# Altium project Schaltbox RemotePC-Renault.PrjPCB
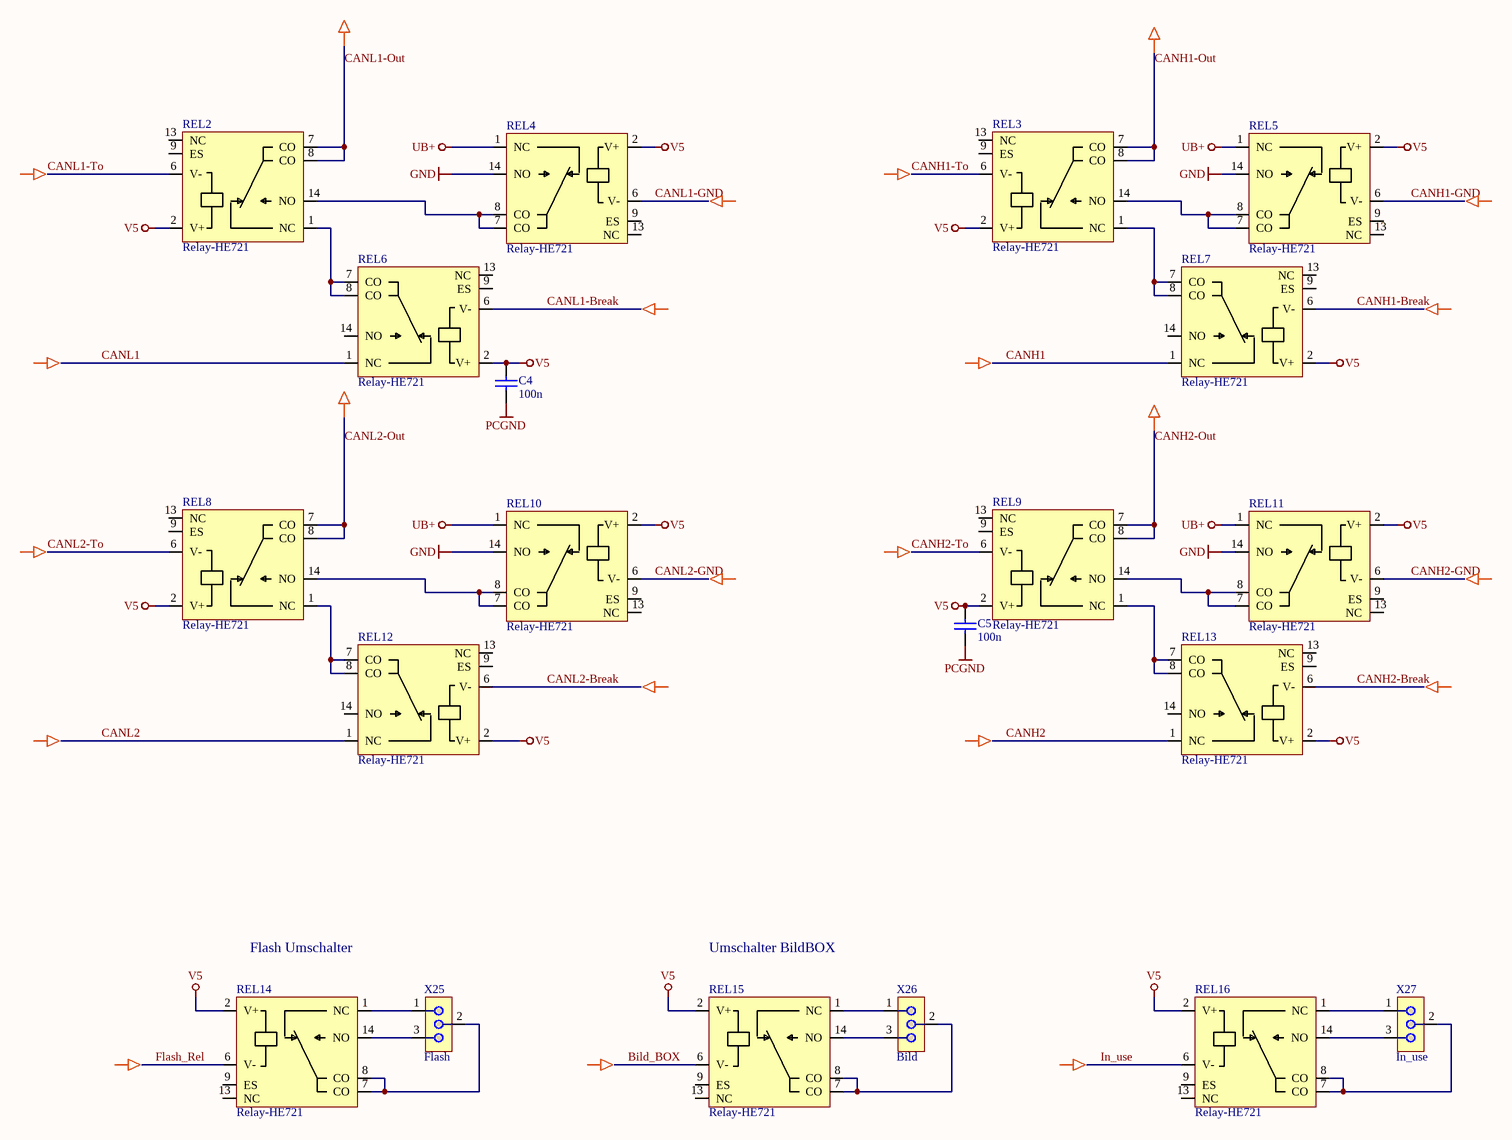
[diagram p0: Schaltbox-Renault_Switch.SchDoc]
3 sheets, 218 parts. Net scope: global (net labels, ports and power ports of the same name join across sheets).
Board file: Schaltbox-Renault_iso.PcbDoc
Sheets:
  Schaltbox-Renault_Switch.SchDoc
  Schaltbox-Renault_Extension.SchDoc
  Schaltbox-Renault_iso.SchDoc

## Sheet Schaltbox-Renault_Switch.SchDoc: Schaltbox für PC I/O - Switches
size A3; Organization: Schleißheimer GmbH; Address2: Am Kalkofen 10; Address3: D-61206 Wöllstadt; Address4: Deutschland; Revision: 1.0; SheetNumber: 2; SheetTotal: 2; PageSetup: Record=PageOptions|CenterHorizontal=True|CenterVertical=True|PrintScale=0.70|XCorrection=1.00|YCorrection=1.00|PrintKind=0|BorderSize=5000000|LeftOffset=0|BottomOffset=0|Orientation=2|PaperLength=1000|PaperWidth=1000|Scale=100|PaperSource=7|PrintQuality=-4|MediaType=1|DitherType=10|PrintScaleMode=1|PaperKind=A4|PaperIndex=9; ProjectName: Remote AP

### Parts
(Parts that share a designator on the sheet are numbered #1, #2 ... from top to bottom, then left to right.)
*#1  Pfeil-->  (value not drawn)  (graphical)
*#2  Pfeil-->  (value not drawn)  (graphical)
*#3  Pfeil-->  (value not drawn)  (graphical)
*#4  Pfeil-->  (value not drawn)  (graphical)
*#5  Pfeil-->  (value not drawn)  (graphical)
*#6  Pfeil-->  (value not drawn)  (graphical)
*#7  Pfeil-->  (value not drawn)  (graphical)
*#8  Pfeil-->  (value not drawn)  (graphical)
*#9  Pfeil-->  (value not drawn)  (graphical)
*#10  Pfeil-->  (value not drawn)  (graphical)
*#11  Pfeil-->  (value not drawn)  (graphical)
*#12  Pfeil-->  (value not drawn)  (graphical)
*#13  Pfeil-->  (value not drawn)  (graphical)
*#14  Pfeil-->  (value not drawn)  (graphical)
*#15  Pfeil-->  (value not drawn)  (graphical)
*#16  Pfeil-->  (value not drawn)  (graphical)
*#17  Pfeil-->  (value not drawn)  (graphical)
*#18  Pfeil-->  (value not drawn)  (graphical)
*#19  Pfeil-->  (value not drawn)  (graphical)
*#20  Pfeil-->  (value not drawn)  (graphical)
*#21  Pfeil-->  (value not drawn)  (graphical)
*#22  Pfeil-->  (value not drawn)  (graphical)
*#23  Pfeil-->  (value not drawn)  (graphical)
C4  100n  [C0603MD]
C5  100n  [C0603MD]
REL2  Relay-HE721  [DIP14 - HE700]
REL3  Relay-HE721  [DIP14 - HE700]
REL4  Relay-HE721  [DIP14 - HE700]
REL5  Relay-HE721  [DIP14 - HE700]
REL6  Relay-HE721  [DIP14 - HE700]
REL7  Relay-HE721  [DIP14 - HE700]
REL8  Relay-HE721  [DIP14 - HE700]
REL9  Relay-HE721  [DIP14 - HE700]
REL10  Relay-HE721  [DIP14 - HE700]
REL11  Relay-HE721  [DIP14 - HE700]
REL12  Relay-HE721  [DIP14 - HE700]
REL13  Relay-HE721  [DIP14 - HE700]
REL14  Relay-HE721  [DIP14 - HE700]
REL15  Relay-HE721  [DIP14 - HE700]
REL16  Relay-HE721  [DIP14 - HE700]
X25  Flash  [Stifte_1x3]
X26  Bild  [Stifte_1x3]
X27  In_use  [Stifte_1x3]

### Nets
GND: REL4.14(NO) REL5.14(NO) REL10.14(NO) REL11.14(NO)
PCGND: C4.1 C5.1
UB+: REL4.1(NC) REL5.1(NC) REL10.1(NC) REL11.1(NC)
V5: C4.2 C5.2 REL2.2(V+) REL3.2(V+) REL4.2(V+) REL5.2(V+) REL6.2(V+) REL7.2(V+) REL8.2(V+) REL9.2(V+) REL10.2(V+) REL11.2(V+) REL12.2(V+) REL13.2(V+) REL14.2(V+) REL15.2(V+) REL16.2(V+)
Bild_BOX: REL15.6(V-)
CANH1: REL7.1(NC)
CANH1-Break: REL7.6(V-)
CANH1-GND: REL5.6(V-)
CANH1-Out: REL3.7(CO) REL3.8(CO)
CANH1-To: REL3.6(V-)
CANH2: REL13.1(NC)
CANH2-Break: REL13.6(V-)
CANH2-GND: REL11.6(V-)
CANH2-Out: REL9.7(CO) REL9.8(CO)
CANH2-To: REL9.6(V-)
CANL1: REL6.1(NC)
CANL1-Break: REL6.6(V-)
CANL1-GND: REL4.6(V-)
CANL1-Out: REL2.7(CO) REL2.8(CO)
CANL1-To: REL2.6(V-)
CANL2: REL12.1(NC)
CANL2-Break: REL12.6(V-)
CANL2-GND: REL10.6(V-)
CANL2-Out: REL8.7(CO) REL8.8(CO)
CANL2-To: REL8.6(V-)
Flash_Rel: REL14.6(V-)
In_use: REL16.6(V-)
NetREL2_1: REL2.1(NC) REL6.7(CO) REL6.8(CO)
NetREL2_14: REL2.14(NO) REL4.7(CO) REL4.8(CO)
NetREL3_1: REL3.1(NC) REL7.7(CO) REL7.8(CO)
NetREL3_14: REL3.14(NO) REL5.7(CO) REL5.8(CO)
NetREL8_1: REL8.1(NC) REL12.7(CO) REL12.8(CO)
NetREL8_14: REL8.14(NO) REL10.7(CO) REL10.8(CO)
NetREL9_1: REL9.1(NC) REL13.7(CO) REL13.8(CO)
NetREL9_14: REL9.14(NO) REL11.7(CO) REL11.8(CO)
NetREL14_1: REL14.1(NC) X25.1
NetREL14_7: REL14.7(CO) REL14.8(CO) X25.2
NetREL14_14: REL14.14(NO) X25.3
NetREL15_1: REL15.1(NC) X26.1
NetREL15_7: REL15.7(CO) REL15.8(CO) X26.2
NetREL15_14: REL15.14(NO) X26.3
NetREL16_1: REL16.1(NC) X27.1
NetREL16_7: REL16.7(CO) REL16.8(CO) X27.2
NetREL16_14: REL16.14(NO) X27.3

Not connected (* = marked no-connect by the designer): REL2 9(ES) 13(NC); REL3 9(ES) 13(NC); REL4 9(ES) 13(NC); REL5 9(ES) 13(NC); REL6 9(ES) 13(NC) 14(NO); REL7 9(ES) 13(NC) 14(NO); REL8 9(ES) 13(NC); REL9 9(ES) 13(NC); REL10 9(ES) 13(NC); REL11 9(ES) 13(NC); REL12 9(ES) 13(NC) 14(NO); REL13 9(ES) 13(NC) 14(NO); REL14 9(ES) 13(NC); REL15 9(ES) 13(NC); REL16 9(ES) 13(NC)

### Notes on the sheet
- Flash Umschalter
- Umschalter BildBOX
- Title
- Size:
- Date:
- A3
- Number:
- Time:
- Revision:
- Sheet
- of
- File:

### Library data of the parts
*#1-*#23 = Pfeil-->: No Footprint
C4 C5 = Cap: Capacitor; Value: 100p; Published: 8-Jun-2000; LatestRevisionDate: 17-Jul-2002; LatestRevisionNote: Re-released for DXP Platform.; PackageReference: RAD-0.3; Publisher: Altium Limited
REL2-REL16 = Relay-HE721: Hamlin Reed-Relay SPDT
X25-X27 = Jumper-3: 3pol Jumper RM 2.54

## Sheet Schaltbox-Renault_Extension.SchDoc: Schaltbox für PC I/O Erweiterung
size A3; Organization: Schleißheimer GmbH; Address2: Am Kalkofen 10; Address3: D-61206 Wöllstadt; Address4: Deutschland; Revision: 1.0; SheetNumber: 3; SheetTotal: 3; PageSetup: Record=PageOptions|CenterHorizontal=True|CenterVertical=True|PrintScale=0.70|XCorrection=1.00|YCorrection=1.00|PrintKind=0|BorderSize=5000000|LeftOffset=0|BottomOffset=0|Orientation=2|PaperLength=1000|PaperWidth=1000|Scale=100|PaperSource=7|PrintQuality=-4|MediaType=1|DitherType=10|PrintScaleMode=1|PaperKind=A4|PaperIndex=9; DocumentName: Schaltbox.SchDoc
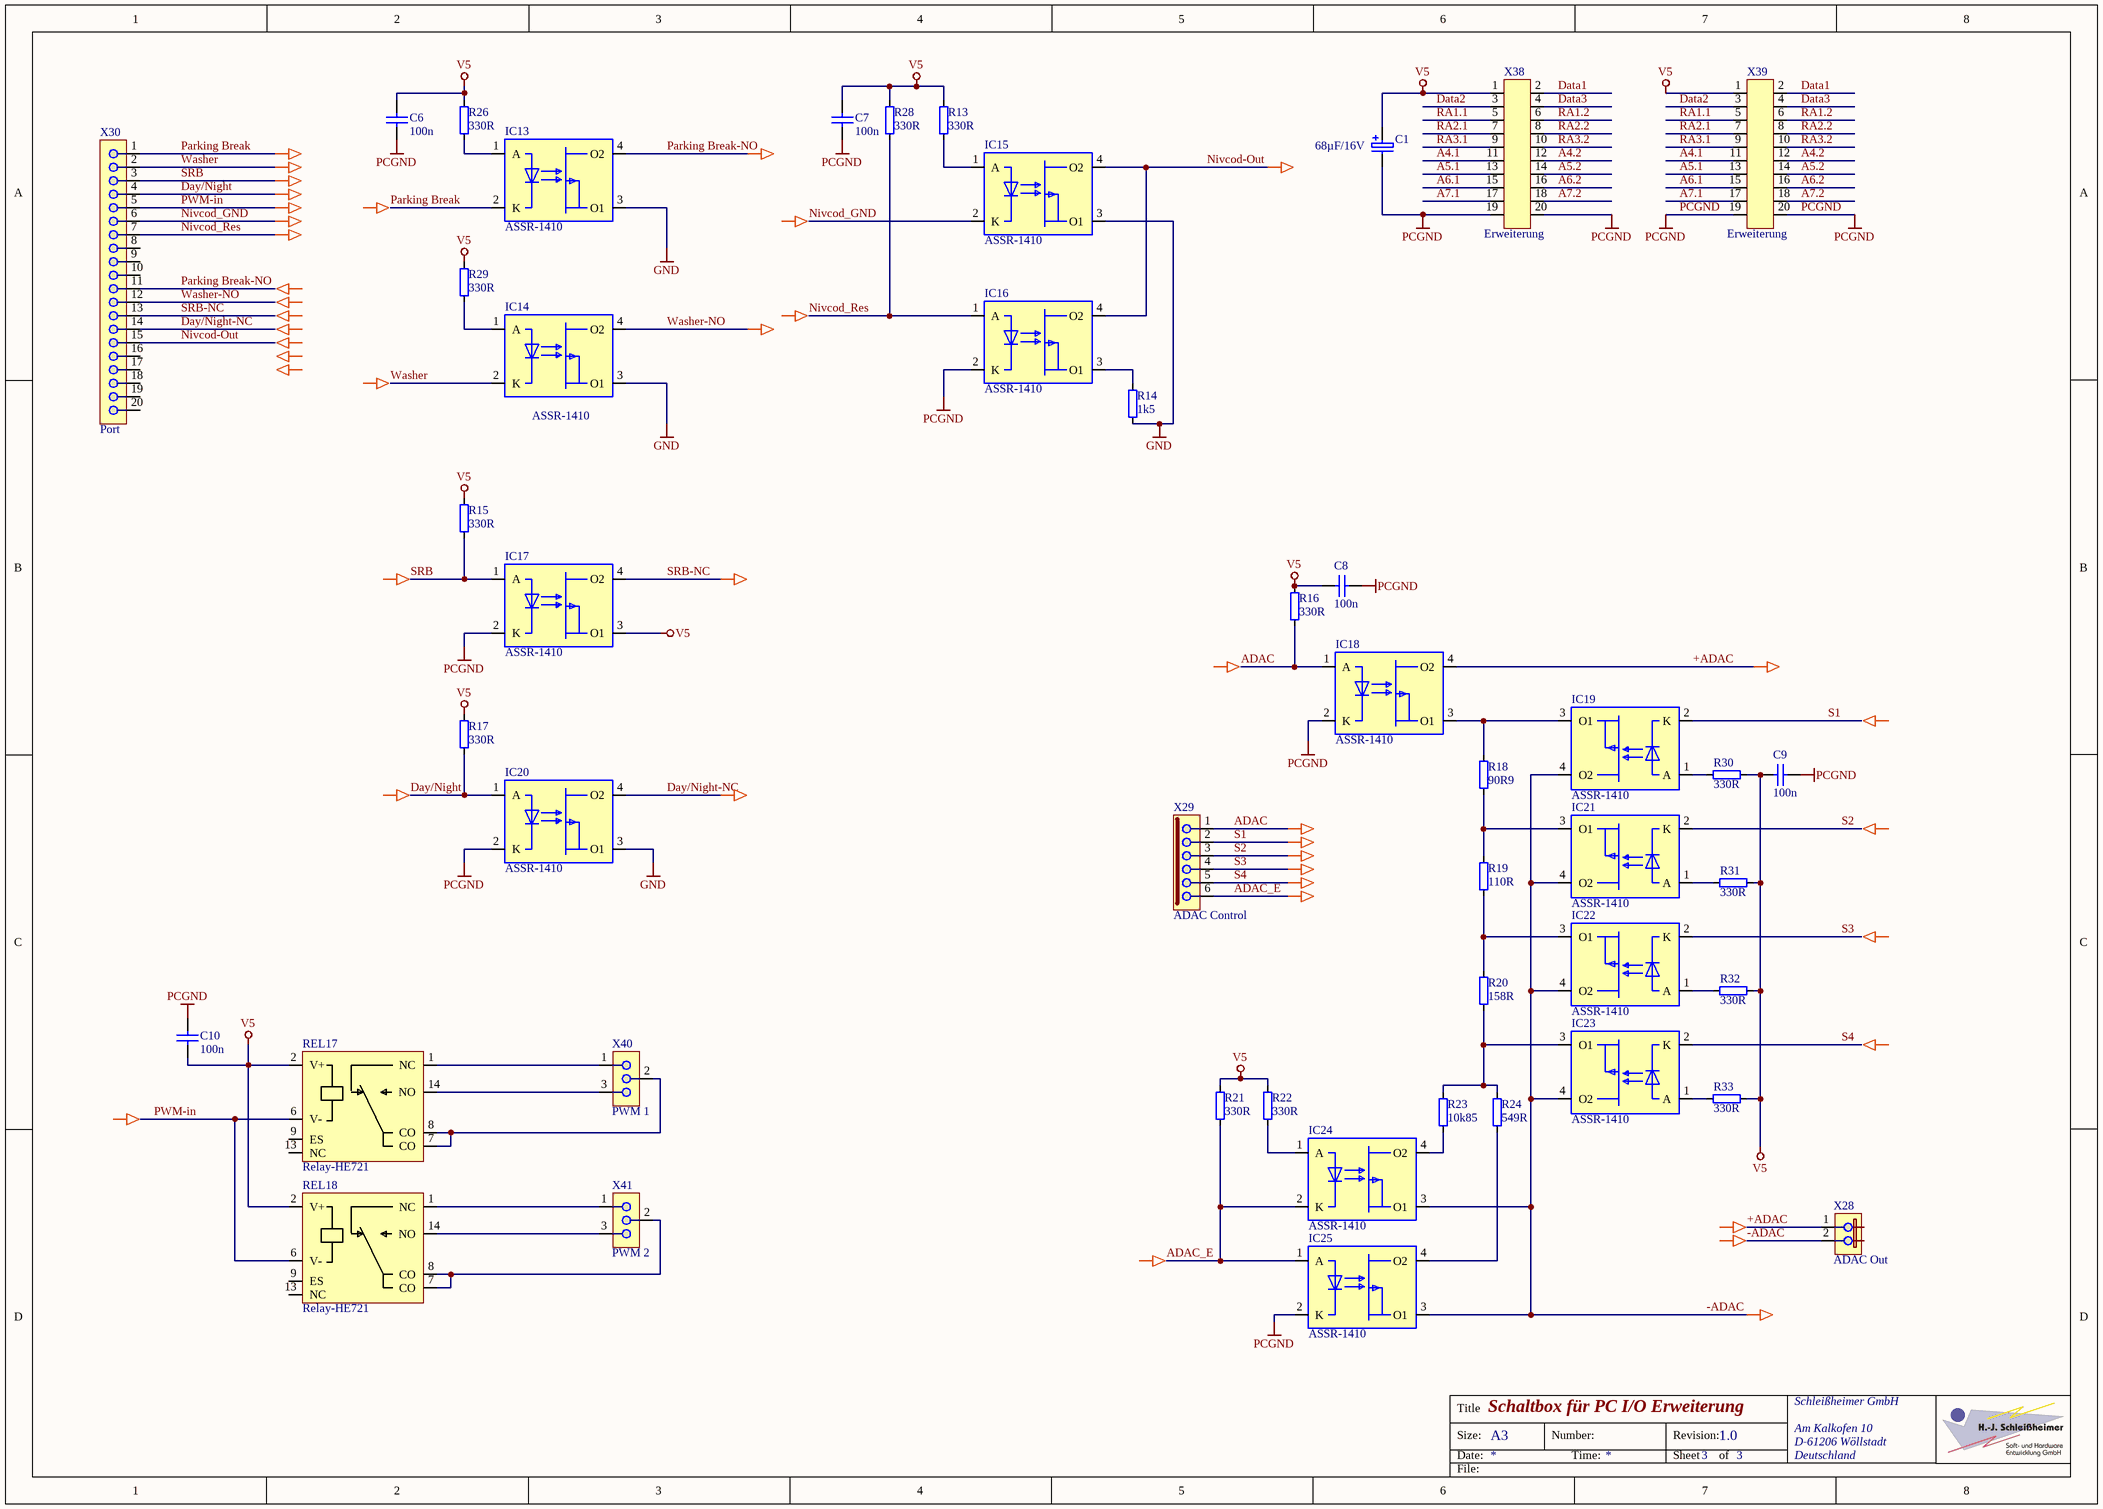
[diagram p1: Schaltbox-Renault_Extension.SchDoc]

### Parts
(Parts that share a designator on the sheet are numbered #1, #2 ... from top to bottom, then left to right.)
*#24  Pfeil-->  (value not drawn)  (graphical)
*#25  Pfeil-->  (value not drawn)  (graphical)
*#26  Pfeil-->  (value not drawn)  (graphical)
*#27  Pfeil-->  (value not drawn)  (graphical)
*#28  Pfeil-->  (value not drawn)  (graphical)
*#29  Pfeil-->  (value not drawn)  (graphical)
*#30  Pfeil-->  (value not drawn)  (graphical)
*#31  Pfeil-->  (value not drawn)  (graphical)
*#32  Pfeil-->  (value not drawn)  (graphical)
*#33  Pfeil-->  (value not drawn)  (graphical)
*#34  Pfeil-->  (value not drawn)  (graphical)
*#35  Pfeil-->  (value not drawn)  (graphical)
*#36  Pfeil-->  (value not drawn)  (graphical)
*#37  Pfeil-->  (value not drawn)  (graphical)
*#38  Pfeil-->  (value not drawn)  (graphical)
*#39  Pfeil-->  (value not drawn)  (graphical)
*#40  Pfeil-->  (value not drawn)  (graphical)
*#41  Pfeil-->  (value not drawn)  (graphical)
*#42  Pfeil-->  (value not drawn)  (graphical)
*#43  Pfeil-->  (value not drawn)  (graphical)
*#44  Pfeil-->  (value not drawn)  (graphical)
*#45  Pfeil-->  (value not drawn)  (graphical)
*#46  Pfeil-->  (value not drawn)  (graphical)
*#47  Pfeil-->  (value not drawn)  (graphical)
*#48  Pfeil-->  (value not drawn)  (graphical)
*#49  Pfeil-->  (value not drawn)  (graphical)
*#50  Pfeil-->  (value not drawn)  (graphical)
*#51  Pfeil-->  (value not drawn)  (graphical)
*#52  Pfeil-->  (value not drawn)  (graphical)
*#53  Pfeil-->  (value not drawn)  (graphical)
*#54  Pfeil-->  (value not drawn)  (graphical)
*#55  Pfeil-->  (value not drawn)  (graphical)
*#56  Pfeil-->  (value not drawn)  (graphical)
*#57  Pfeil-->  (value not drawn)  (graphical)
*#58  Pfeil-->  (value not drawn)  (graphical)
*#59  Pfeil-->  (value not drawn)  (graphical)
*#60  Pfeil-->  (value not drawn)  (graphical)
*#61  Pfeil-->  (value not drawn)  (graphical)
*#62  Pfeil-->  (value not drawn)  (graphical)
*#63  Pfeil-->  (value not drawn)  (graphical)
*#64  Pfeil-->  (value not drawn)  (graphical)
*#65  Pfeil-->  (value not drawn)  (graphical)
C1  68µF/16V  [ALU-D]
C6  100n  [C0603MD]
C7  100n  [C0603MD]
C8  100n  [C0603MD]
C9  100n  [C0603MD]
C10  100n  [C0603MD]
IC13  ASSR-1410  [SO-4]
IC14  ASSR-1410  [SO-4]
IC15  ASSR-1410  [SO-4]
IC16  ASSR-1410  [SO-4]
IC17  ASSR-1410  [SO-4]
IC18  ASSR-1410  [SO-4]
IC19  ASSR-1410  [SO-4]
IC20  ASSR-1410  [SO-4]
IC21  ASSR-1410  [SO-4]
IC22  ASSR-1410  [SO-4]
IC23  ASSR-1410  [SO-4]
IC24  ASSR-1410  [SO-4]
IC25  ASSR-1410  [SO-4]
R13  330R  [R0603MD]
R14  1k5  [R0603MD]
R15  330R  [R0603MD]
R16  330R  [R0603MD]
R17  330R  [R0603MD]
R18  90R9  [R0805MD]
R19  110R  [R0805MD]
R20  158R  [R0805MD]
R21  330R  [R0603MD]
R22  330R  [R0603MD]
R23  10k85  [R0805MD]
R24  549R  [R0805MD]
R26  330R  [R0603MD]
R28  330R  [R0603MD]
R29  330R  [R0603MD]
R30  330R  [R0603MD]
R31  330R  [R0603MD]
R32  330R  [R0603MD]
R33  330R  [R0603MD]
REL17  Relay-HE721  [DIP14 - HE700]
REL18  Relay-HE721  [DIP14 - HE700]
X28  ADAC Out  [Stifte_1x2]
X29  ADAC Control  [Stifte_1x6]
X30  Port  [Stifte_1x20]
X38  Erweiterung  [SchneidKlemm_20]
X39  Erweiterung  [SchneidKlemm_20]
X40  PWM 1  [Stifte_1x3]
X41  PWM 2  [Stifte_1x3]

### Nets
GND: IC13.3(O1) IC14.3(O1) IC15.3(O1) IC20.3(O1) R14.1
PCGND: C1.N C6.1 C7.1 C8.1 C9.1 C10.2 IC16.2(K) IC17.2(K) IC18.2(K) IC20.2(K) IC25.2(K) X38.19 X38.20 X39.19 X39.20
V5: C1.P C6.2 C7.2 C8.2 C9.2 C10.1 IC17.3(O1) R13.2 R15.2 R16.2 R17.2 R21.2 R22.2 R26.2 R28.2 R29.2 R30.1 R31.1 R32.1 R33.1 REL17.2(V+) REL18.2(V+) X38.1 X39.1
+ADAC: IC18.4(O2) X28.1
-ADAC: IC19.4(O2) IC21.4(O2) IC22.4(O2) IC23.4(O2) IC24.3(O1) IC25.3(O1) X28.2
A4.1: X38.11 X39.11
A4.2: X38.12 X39.12
A5.1: X38.13 X39.13
A5.2: X38.14 X39.14
A6.1: X38.15 X39.15
A6.2: X38.16 X39.16
A7.1: X38.17 X39.17
A7.2: X38.18 X39.18
ADAC: IC18.1(A) R16.1 X29.1
ADAC_E: IC24.2(K) IC25.1(A) R21.1 X29.6
Data1: X38.2 X39.2
Data2: X38.3 X39.3
Data3: X38.4 X39.4
Day/Night: IC20.1(A) R17.1 X30.4
Day/Night-NC: IC20.4(O2) X30.14
Nivcod-Out: IC15.4(O2) IC16.4(O2) X30.15
Nivcod_GND: IC15.2(K) X30.6
Nivcod_Res: IC16.1(A) R28.1 X30.7
Parking Break: IC13.2(K) X30.1
Parking Break-NO: IC13.4(O2) X30.11
PWM-in: REL17.6(V-) REL18.6(V-) X30.5
RA1.1: X38.5 X39.5
RA1.2: X38.6 X39.6
RA2.1: X38.7 X39.7
RA2.2: X38.8 X39.8
RA3.1: X38.9 X39.9
RA3.2: X38.10 X39.10
S1: IC19.2(K) X29.2
S2: IC21.2(K) X29.3
S3: IC22.2(K) X29.4
S4: IC23.2(K) X29.5
SRB: IC17.1(A) R15.1 X30.3
SRB-NC: IC17.4(O2) X30.13
Washer: IC14.2(K) X30.2
Washer-NO: IC14.4(O2) X30.12
NetIC13_1: IC13.1(A) R26.1
NetIC14_1: IC14.1(A) R29.1
NetIC15_1: IC15.1(A) R13.1
NetIC16_3: IC16.3(O1) R14.2
NetIC18_3: IC18.3(O1) IC19.3(O1) R18.2
NetIC19_1: IC19.1(A) R30.2
NetIC21_1: IC21.1(A) R31.2
NetIC21_3: IC21.3(O1) R18.1 R19.2
NetIC22_1: IC22.1(A) R32.2
NetIC22_3: IC22.3(O1) R19.1 R20.2
NetIC23_1: IC23.1(A) R33.2
NetIC23_3: IC23.3(O1) R20.1 R23.2 R24.2
NetIC24_1: IC24.1(A) R22.1
NetIC24_4: IC24.4(O2) R23.1
NetIC25_4: IC25.4(O2) R24.1
NetREL17_1: REL17.1(NC) X40.1
NetREL17_7: REL17.7(CO) REL17.8(CO) X40.2
NetREL17_14: REL17.14(NO) X40.3
NetREL18_1: REL18.1(NC) X41.1
NetREL18_7: REL18.7(CO) REL18.8(CO) X41.2
NetREL18_14: REL18.14(NO) X41.3

Not connected (* = marked no-connect by the designer): REL17 9(ES) 13(NC); REL18 9(ES) 13(NC); X30 8 9 10 16 17 18 19 20

### Notes on the sheet
- Title
- Size:
- Date:
- A3
- Number:
- Time:
- Revision:
- Sheet
- of
- File:

### Library data of the parts
*#24-*#65 = Pfeil-->: No Footprint
C1 = Cap Pol: Capacitor Polarized; Published: 8-Jun-2000; LatestRevisionDate: 17-Jul-2002; LatestRevisionNote: Re-released for DXP Platform.; PackageReference: C0805; Publisher: Altium Limited; Value: 68µF/16V
C6-C10 = Cap: Capacitor; Value: 100p; Published: 8-Jun-2000; LatestRevisionDate: 17-Jul-2002; LatestRevisionNote: Re-released for DXP Platform.; PackageReference: RAD-0.3; Publisher: Altium Limited
IC13-IC25 = ASSR-1410: Solid State Relay, (Photo MOSFET)
R13-R24 R26 R28-R33 = Res: Resistor
REL17 REL18 = Relay-HE721: Hamlin Reed-Relay SPDT
X28 = Jumper-2: 2pol Jumper RM 2.54
X29 = Stecker-6pol: Stecker 1reihig 6polig
X30 = Stifte 1x20: Stiftleiste, Buchsenleiste
X38 X39 = CON-2x10: Stift-, Buchs2x10, SchneidKlemm 20pol.
X40 X41 = Jumper-3: 3pol Jumper RM 2.54

## Sheet Schaltbox-Renault_iso.SchDoc: Schaltbox für PC I/O Power
size A3; Organization: Schleißheimer GmbH; Address2: Am Kalkofen 10; Address3: D-61206 Wöllstadt; Address4: Deutschland; Revision: 1.0; SheetNumber: 1; SheetTotal: 3; PageSetup: Record=PageOptions|CenterHorizontal=True|CenterVertical=True|PrintScale=0.70|XCorrection=1.00|YCorrection=1.00|PrintKind=0|BorderSize=5000000|LeftOffset=0|BottomOffset=0|Orientation=2|PaperLength=1000|PaperWidth=1000|Scale=100|PaperSource=7|PrintQuality=-4|MediaType=1|DitherType=10|PrintScaleMode=1|PaperKind=A4|PaperIndex=9; DocumentName: Schaltbox.SchDoc
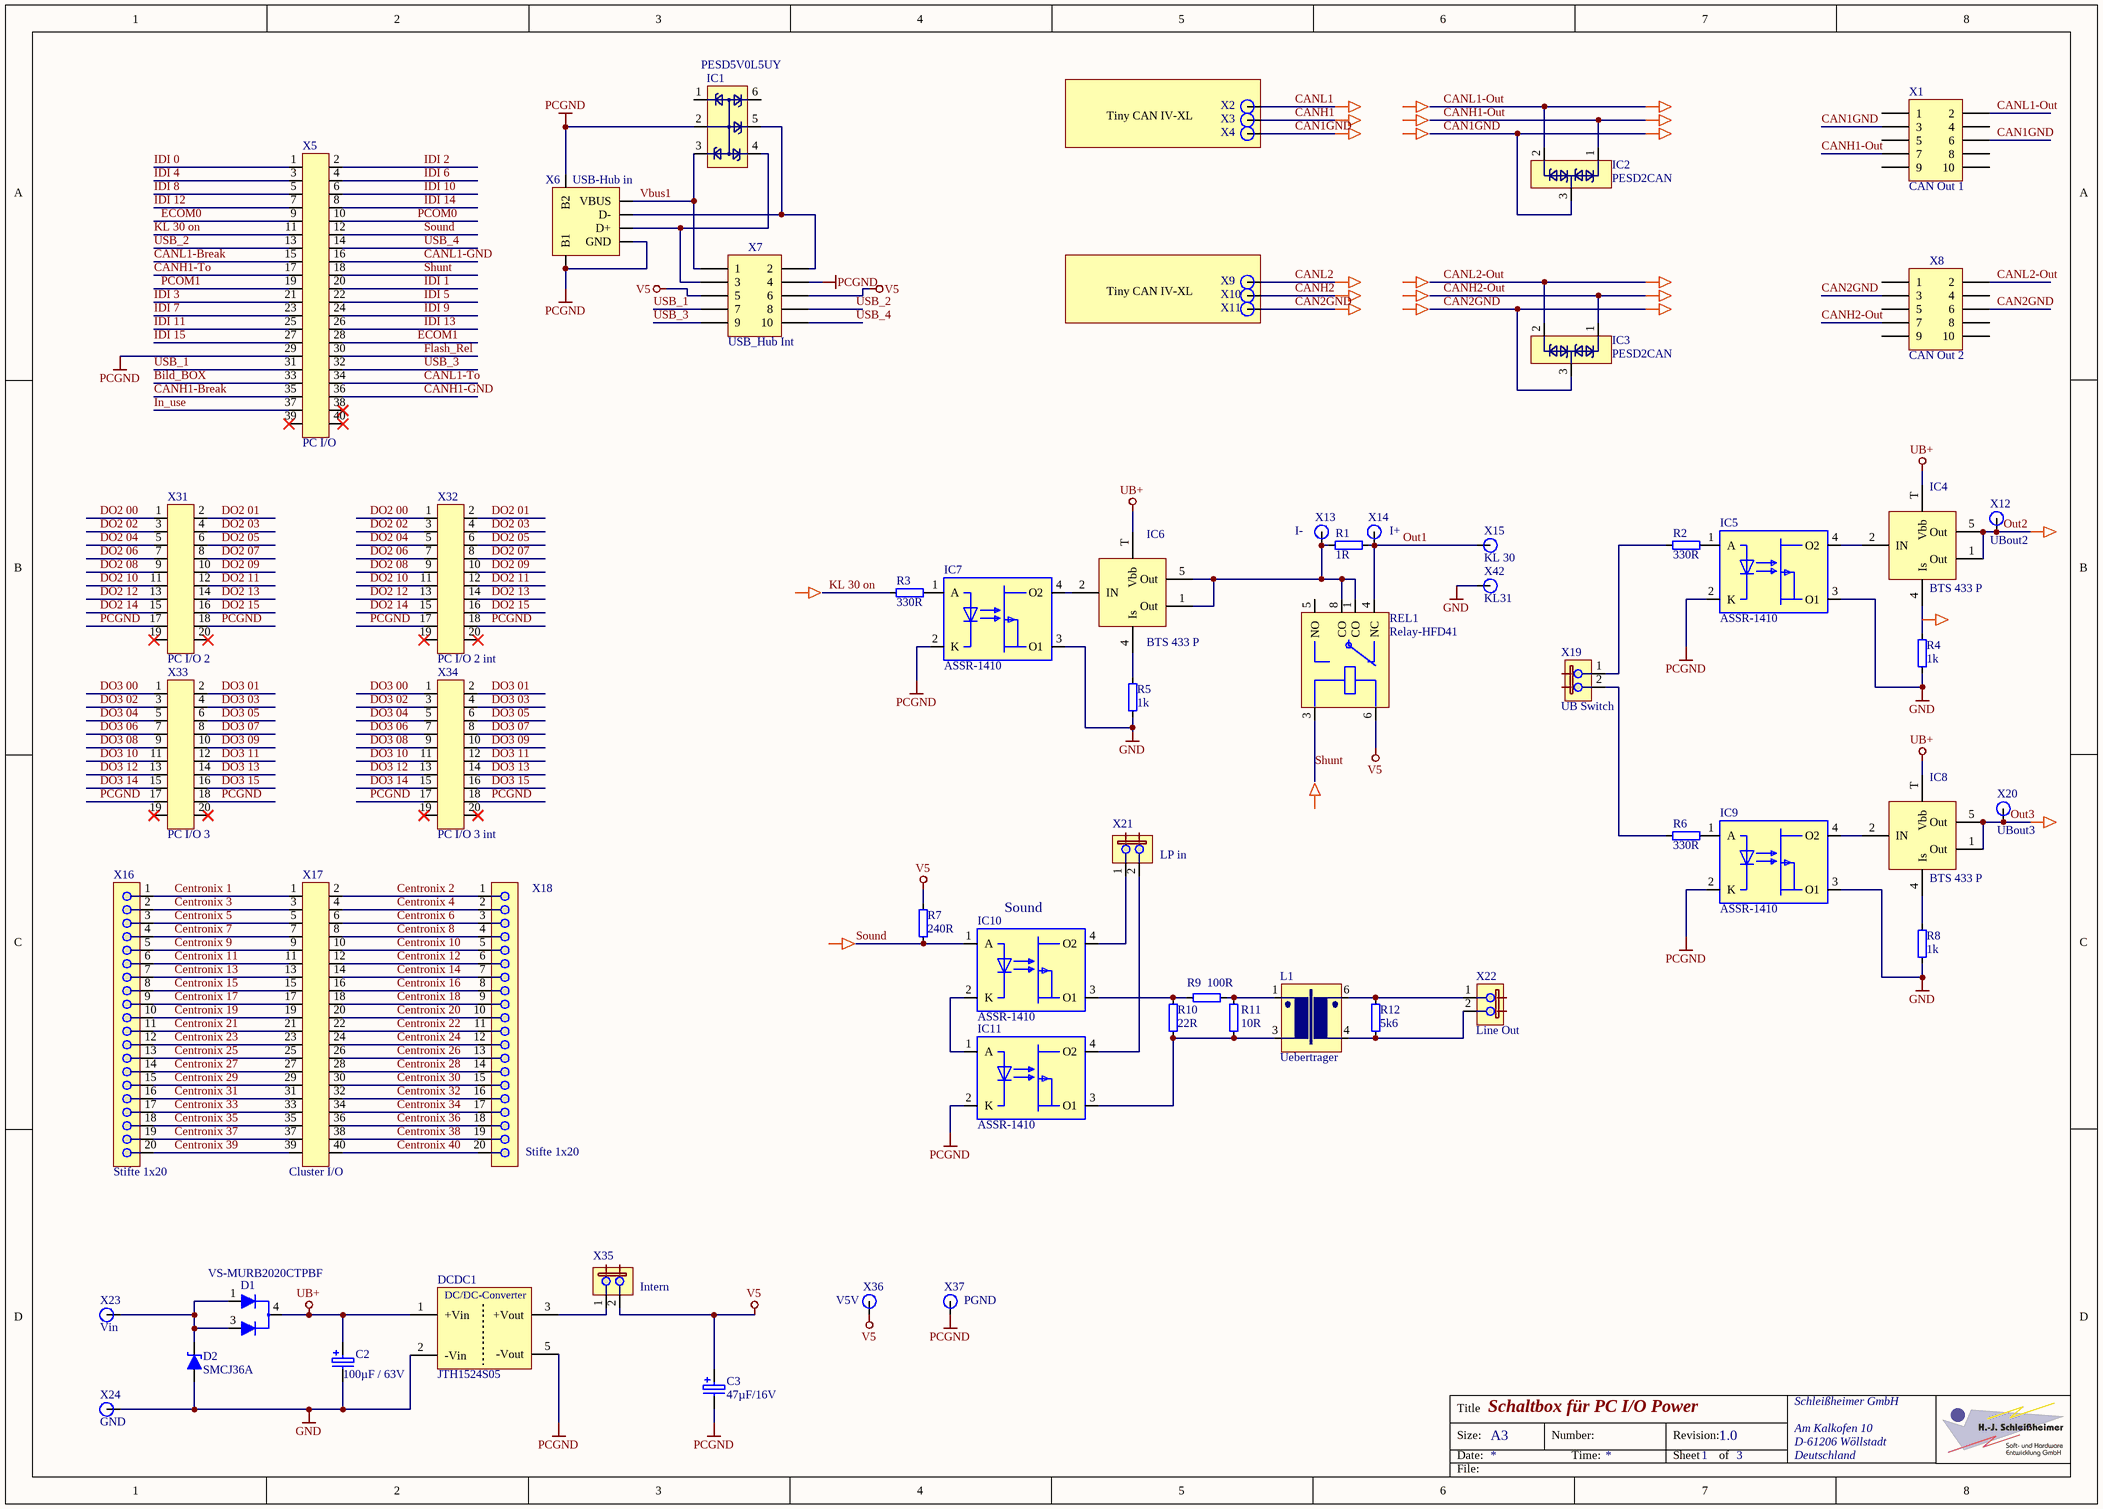
[diagram p2: Schaltbox-Renault_iso.SchDoc]

### Parts
(Parts that share a designator on the sheet are numbered #1, #2 ... from top to bottom, then left to right.)
*#66  Pfeil-->  (value not drawn)  (graphical)
*#67  Pfeil-->  (value not drawn)  (graphical)
*#68  Pfeil-->  (value not drawn)  (graphical)
*#69  Pfeil-->  (value not drawn)  (graphical)
*#70  Pfeil-->  (value not drawn)  (graphical)
*#71  Pfeil-->  (value not drawn)  (graphical)
*#72  Pfeil-->  (value not drawn)  (graphical)
*#73  Pfeil-->  (value not drawn)  (graphical)
*#74  Pfeil-->  (value not drawn)  (graphical)
*#75  Pfeil-->  (value not drawn)  (graphical)
*#76  Pfeil-->  (value not drawn)  (graphical)
*#77  Pfeil-->  (value not drawn)  (graphical)
*#78  Pfeil-->  (value not drawn)  (graphical)
*#79  Pfeil-->  (value not drawn)  (graphical)
*#80  Pfeil-->  (value not drawn)  (graphical)
*#81  Pfeil-->  (value not drawn)  (graphical)
*#82  Pfeil-->  (value not drawn)  (graphical)
*#83  Pfeil-->  (value not drawn)  (graphical)
*#84  Pfeil-->  (value not drawn)  (graphical)
*#85  Pfeil-->  (value not drawn)  (graphical)
*#86  Pfeil-->  (value not drawn)  (graphical)
*#87  Pfeil-->  (value not drawn)  (graphical)
*#88  Pfeil-->  (value not drawn)  (graphical)
*#89  Pfeil-->  (value not drawn)  (graphical)
C2  100µF / 63V  [ALU-G]
C3  47µF/16V  [ALU-D]
D1  VS-MURB2020CTPBF  [TO252-3_LD_(DPAK)]
D2  SMCJ36A  [SMC_MD_(DO214AB)]
DCDC1  JTH1524S05  [JTH15]
IC1  PESD5V0L5UY  [SOT363_MD_(SC88 / SC70-6)]
IC2  PESD2CAN  [SOT23_MD]
IC3  PESD2CAN  [SOT23_MD]
IC4  BTS 433 P  [TO252-5_MD_(DPAK)]
IC5  ASSR-1410  [SO-4]
IC6  BTS 433 P  [TO252-5_MD_(DPAK)]
IC7  ASSR-1410  [SO-4]
IC8  BTS 433 P  [TO252-5_MD_(DPAK)]
IC9  ASSR-1410  [SO-4]
IC10  ASSR-1410  [SO-4]
IC11  ASSR-1410  [SO-4]
L1  Uebertrager  [SM-LP]
R1  1R  [R2512HD]
R2  330R  [R0603MD]
R3  330R  [R0603HD]
R4  1k  [R0603HD]
R5  1k  [R0603HD]
R6  330R  [R0603MD]
R7  240R  [R0603MD]
R8  1k  [R0603HD]
R9  100R  [R0603MD]
R10  22R  [R0805MD]
R11  10R  [R0603MD]
R12  5k6  [R0603MD]
REL1  Relay-HFD41  [REL_HFD41]
X1  CAN Out 1  [HDR2X5]
X2  Anschlusspin  [Loetpad_Oval_0.8]  (value not drawn)
X3  Anschlusspin  [Loetpad_Oval_0.8]  (value not drawn)
X4  Anschlusspin  [Loetpad_Oval_0.8]  (value not drawn)
X5  PC I/O  [SchneidKlemm_40]
X6  USB-Hub in  [USB_TypB]
X7  USB_Hub Int  [HDR2X5]
X8  CAN Out 2  [HDR2X5]
X9  Anschlusspin  [Loetpad_Oval_0.8]  (value not drawn)
X10  Anschlusspin  [Loetpad_Oval_0.8]  (value not drawn)
X11  Anschlusspin  [Loetpad_Oval_0.8]  (value not drawn)
X12  UBout2  [Loetoese-3.2]
X13  I-  [Loetpad_Oval_0.8]
X14  I+  [Loetpad_Oval_0.8]
X15  KL 30  [Loetoese-3.2]
X16  Stifte 1x20  [Stifte_1x20]
X17  Cluster I/O  [SchneidKlemm_40]
X18  Stifte 1x20  [Stifte_1x20]
X19  UB Switch  [Stifte_1x2]
X20  UBout3  [Loetoese-3.2]
X21  LP in  [Stifte_1x2]
X22  Line Out  [Stifte_1x2]
X23  Vin  [Loetoese-3.2]
X24  GND  [Loetoese-3.2]
X31  PC I/O 2  [SchneidKlemm_20]
X32  PC I/O 2 int  [SchneidKlemm_20]
X33  PC I/O 3  [SchneidKlemm_20]
X34  PC I/O 3 int  [SchneidKlemm_20]
X35  Intern  [Stifte_1x2]
X36  V5V  [Loetpad_Oval_0.8]
X37  PGND  [Loetpad_Oval_0.8]
X42  KL31  [Loetoese-3.2]

### Nets
GND: C2.N D2.2 DCDC1.2(-Vin) IC5.3(O1) IC7.3(O1) IC9.3(O1) R4.1 R5.1 R8.1 X24.1 X42.1
PCGND: C3.N DCDC1.5(-Vout) IC1.2 IC5.2(K) IC7.2(K) IC9.2(K) IC11.2(K) X5.29 X6.B1 X6.B2 X6.GND X7.4 X31.17 X31.18 X32.17 X32.18 X33.17 X33.18 X34.17 X34.18 X37.1
UB+: C2.P D1.4(K) DCDC1.1(+Vin) IC4.T(Vbb) IC6.T(Vbb) IC8.T(Vbb)
V5: C3.P R7.2 REL1.6 X7.5 X7.6 X35.2 X36.1
Bild_BOX: X5.33
CAN1GND: IC2.3 X1.3 X1.6 X4.1
CAN2GND: IC3.3 X8.3 X8.6 X11.1
CANH1: X3.1
CANH1-Break: X5.35
CANH1-GND: X5.36
CANH1-Out: IC2.1 X1.7
CANH1-To: X5.17
CANH2: X10.1
CANH2-Out: IC3.1 X8.7
CANL1: X2.1
CANL1-Break: X5.15
CANL1-GND: X5.16
CANL1-Out: IC2.2 X1.2
CANL1-To: X5.34
CANL2: X9.1
CANL2-Out: IC3.2 X8.2
Centronix 1: X16.1 X17.1
Centronix 2: X17.2 X18.1
Centronix 3: X16.2 X17.3
Centronix 4: X17.4 X18.2
Centronix 5: X16.3 X17.5
Centronix 6: X17.6 X18.3
Centronix 7: X16.4 X17.7
Centronix 8: X17.8 X18.4
Centronix 9: X16.5 X17.9
Centronix 10: X17.10 X18.5
Centronix 11: X16.6 X17.11
Centronix 12: X17.12 X18.6
Centronix 13: X16.7 X17.13
Centronix 14: X17.14 X18.7
Centronix 15: X16.8 X17.15
Centronix 16: X17.16 X18.8
Centronix 17: X16.9 X17.17
Centronix 18: X17.18 X18.9
Centronix 19: X16.10 X17.19
Centronix 20: X17.20 X18.10
Centronix 21: X16.11 X17.21
Centronix 22: X17.22 X18.11
Centronix 23: X16.12 X17.23
Centronix 24: X17.24 X18.12
Centronix 25: X16.13 X17.25
Centronix 26: X17.26 X18.13
Centronix 27: X16.14 X17.27
Centronix 28: X17.28 X18.14
Centronix 29: X16.15 X17.29
Centronix 30: X17.30 X18.15
Centronix 31: X16.16 X17.31
Centronix 32: X17.32 X18.16
Centronix 33: X16.17 X17.33
Centronix 34: X17.34 X18.17
Centronix 35: X16.18 X17.35
Centronix 36: X17.36 X18.18
Centronix 37: X16.19 X17.37
Centronix 38: X17.38 X18.19
Centronix 39: X16.20 X17.39
Centronix 40: X17.40 X18.20
DO2 00: X31.1 X32.1
DO2 01: X31.2 X32.2
DO2 02: X31.3 X32.3
DO2 03: X31.4 X32.4
DO2 04: X31.5 X32.5
DO2 05: X31.6 X32.6
DO2 06: X31.7 X32.7
DO2 07: X31.8 X32.8
DO2 08: X31.9 X32.9
DO2 09: X31.10 X32.10
DO2 10: X31.11 X32.11
DO2 11: X31.12 X32.12
DO2 12: X31.13 X32.13
DO2 13: X31.14 X32.14
DO2 14: X31.15 X32.15
DO2 15: X31.16 X32.16
DO3 00: X33.1 X34.1
DO3 01: X33.2 X34.2
DO3 02: X33.3 X34.3
DO3 03: X33.4 X34.4
DO3 04: X33.5 X34.5
DO3 05: X33.6 X34.6
DO3 06: X33.7 X34.7
DO3 07: X33.8 X34.8
DO3 08: X33.9 X34.9
DO3 09: X33.10 X34.10
DO3 10: X33.11 X34.11
DO3 11: X33.12 X34.12
DO3 12: X33.13 X34.13
DO3 13: X33.14 X34.14
DO3 14: X33.15 X34.15
DO3 15: X33.16 X34.16
ECOM0: X5.9
ECOM1: X5.28
Flash_Rel: X5.30
IDI 0: X5.1
IDI 1: X5.20
IDI 2: X5.2
IDI 3: X5.21
IDI 4: X5.3
IDI 5: X5.22
IDI 6: X5.4
IDI 7: X5.23
IDI 8: X5.5
IDI 9: X5.24
IDI 10: X5.6
IDI 11: X5.25
IDI 12: X5.7
IDI 13: X5.26
IDI 14: X5.8
IDI 15: X5.27
In_use: X5.37
KL 30 on: R3.2 X5.11
Out1: R1.1 REL1.4(NC) X14.1 X15.1
Out2: IC4.1(Out) IC4.5(Out) X12.1
Out3: IC8.1(Out) IC8.5(Out) X20.1
PCOM0: X5.10
PCOM1: X5.19
Shunt: REL1.3 X5.18
Sound: IC10.1(A) R7.1 X5.12
USB_1: X5.31 X7.7
USB_2: X5.13 X7.8
USB_3: X5.32 X7.9
USB_4: X5.14 X7.10
Vbus1: IC1.3 X6.VBUS X7.1
NetD1_1: D1.1(A1) D1.3(A2) D2.1 X23.1
NetDCDC1_3: DCDC1.3(+Vout) X35.1
NetIC1_4: IC1.4 X6.D+ X7.3
NetIC1_5: IC1.5 X6.D- X7.2
NetIC4_2: IC4.2(IN) IC5.4(O2)
NetIC4_4: IC4.4(Is) R4.2
NetIC5_1: IC5.1(A) R2.1
NetIC6_1: IC6.1(Out) IC6.5(Out) R1.2 REL1.1(CO) REL1.8(CO) X13.1
NetIC6_2: IC6.2(IN) IC7.4(O2)
NetIC6_4: IC6.4(Is) R5.2
NetIC7_1: IC7.1(A) R3.1
NetIC8_2: IC8.2(IN) IC9.4(O2)
NetIC8_4: IC8.4(Is) R8.2
NetIC9_1: IC9.1(A) R6.1
NetIC10_2: IC10.2(K) IC11.1(A)
NetIC10_3: IC10.3(O1) R9.2 R10.2
NetIC10_4: IC10.4(O2) X21.1
NetIC11_3: IC11.3(O1) L1.3 R10.1 R11.1
NetIC11_4: IC11.4(O2) X21.2
NetL1_1: L1.1 R9.1 R11.2
NetL1_4: L1.4 R12.1 X22.2
NetL1_6: L1.6 R12.2 X22.1
NetR2_2: R2.2 X19.1
NetR6_2: R6.2 X19.2

Not connected (* = marked no-connect by the designer): IC1 1 6; REL1 5(NO); X1 1 4 5 8 9 10; X5 38* 39* 40*; X8 1 4 5 8 9 10; X31 19* 20*; X32 19* 20*; X33 19* 20*; X34 19* 20*

### Notes on the sheet
- Tiny CAN IV-XL
- (near IC10) Sound
- Title
- Size:
- Date:
- A3
- Number:
- Time:
- Revision:
- Sheet
- of
- File:
- (in symbol DC/DC-JTH15) DC/DC-Converter

### Library data of the parts
*#66-*#89 = Pfeil-->: No Footprint
C2 C3 = Cap Pol: Capacitor Polarized; Published: 8-Jun-2000; LatestRevisionDate: 17-Jul-2002; LatestRevisionNote: Re-released for DXP Platform.; PackageReference: C0805; Publisher: Altium Limited
  C2: Value: 100µF / 63V
  C3: Value: 47µF/16V
D1 = MURD620CT: Schottky Barrier Double Diode; Published: 17-Sep-2003; LatestRevisionDate: 12-Dec-2006; LatestRevisionNote: IPC-7351 Footprint Added.; DatasheetVersion: 4-Mar-2002; PackageVersion: May-1999; PackageReference: SOT23; Publisher: Altium Limited; PackageDescription: 3-Pin SOT-23 Package 0.95 mm Pitch, 2.3 mm Lead Span; ComponentLink1Description: Manufacturer Link; ComponentLink1URL: http://www.semiconductors.philips.com/; ComponentLink2Description: Datasheet; ComponentLink2URL: http://www.semiconductors.philips.com/acrobat/datasheets/BAT54_SERIES_4.pdf
D2 = SMCJ36A: Suppressor Diode, unidirektional, 36V, 1500 W, fFotprint SMC
DCDC1 = DC/DC-JTH15: 15W-Wandler Single; TYPE: JTH1524S05
IC1 = PESD5V0L5UY: ESD_Protection 5 Lines
IC2 IC3 = PESD2CAN: ESD-Protection CAN-Bus
IC4 IC6 IC8 = BTS443 P
IC5 IC7 IC9-IC11 = ASSR-1410: Solid State Relay, (Photo MOSFET)
L1 = Uebertrager: SM-LP-5001 Series -Surface Mount Line Matching Transformers
R1-R12 = Res: Resistor
  R2 R3 R6: VALUE: 330R
  R4 R5 R8: VALUE: 1k
REL1 = Relay-HFD41: Relay Hongfa Typ HFD41, SPDT, 2A/ 250VAC/30VDC
X1 X7 X8 = Header 5X2: Header, 5-Pin, Dual row; LatestRevisionDate: 17-Jul-2002; LatestRevisionNote: Re-released for DXP Platform.; Publisher: Altium Limited
X2-X4 X9-X15 X20 X23 X24 X36 X37 X42 = Anschlusspin: Anschluss, Bohrung 1.2mm
X5 X17 = CON-40pol: Schneid-Klemm-Verbinder 40pol
X6 = USB-Typ AB: USB-Stecker-Typ A und B,THT
X16 X18 = Stifte 1x20: Stiftleiste, Buchsenleiste
X19 X21 X22 X35 = Jumper-2: 2pol Jumper RM 2.54
X31-X34 = CON-2x10: Stift-, Buchs2x10, SchneidKlemm 20pol.

## Nets that join several sheets
GND: Schaltbox-Renault_Switch (REL4.14 REL5.14 REL10.14 REL11.14), Schaltbox-Renault_Extension (5 pins), Schaltbox-Renault_iso (11 pins)
PCGND: Schaltbox-Renault_Switch (C4.1 C5.1), Schaltbox-Renault_Extension (15 pins), Schaltbox-Renault_iso (21 pins)
UB+: Schaltbox-Renault_Switch (REL4.1 REL5.1 REL10.1 REL11.1), Schaltbox-Renault_iso (6 pins)
V5: Schaltbox-Renault_Switch (17 pins), Schaltbox-Renault_Extension (24 pins), Schaltbox-Renault_iso (7 pins)
Bild_BOX: Schaltbox-Renault_Switch (REL15.6), Schaltbox-Renault_iso (X5.33)
CANH1: Schaltbox-Renault_Switch (REL7.1), Schaltbox-Renault_iso (X3.1)
CANH1-Break: Schaltbox-Renault_Switch (REL7.6), Schaltbox-Renault_iso (X5.35)
CANH1-GND: Schaltbox-Renault_Switch (REL5.6), Schaltbox-Renault_iso (X5.36)
CANH1-Out: Schaltbox-Renault_Switch (REL3.7 REL3.8), Schaltbox-Renault_iso (IC2.1 X1.7)
CANH1-To: Schaltbox-Renault_Switch (REL3.6), Schaltbox-Renault_iso (X5.17)
CANH2: Schaltbox-Renault_Switch (REL13.1), Schaltbox-Renault_iso (X10.1)
CANH2-Out: Schaltbox-Renault_Switch (REL9.7 REL9.8), Schaltbox-Renault_iso (IC3.1 X8.7)
CANL1: Schaltbox-Renault_Switch (REL6.1), Schaltbox-Renault_iso (X2.1)
CANL1-Break: Schaltbox-Renault_Switch (REL6.6), Schaltbox-Renault_iso (X5.15)
CANL1-GND: Schaltbox-Renault_Switch (REL4.6), Schaltbox-Renault_iso (X5.16)
CANL1-Out: Schaltbox-Renault_Switch (REL2.7 REL2.8), Schaltbox-Renault_iso (IC2.2 X1.2)
CANL1-To: Schaltbox-Renault_Switch (REL2.6), Schaltbox-Renault_iso (X5.34)
CANL2: Schaltbox-Renault_Switch (REL12.1), Schaltbox-Renault_iso (X9.1)
CANL2-Out: Schaltbox-Renault_Switch (REL8.7 REL8.8), Schaltbox-Renault_iso (IC3.2 X8.2)
Flash_Rel: Schaltbox-Renault_Switch (REL14.6), Schaltbox-Renault_iso (X5.30)
In_use: Schaltbox-Renault_Switch (REL16.6), Schaltbox-Renault_iso (X5.37)